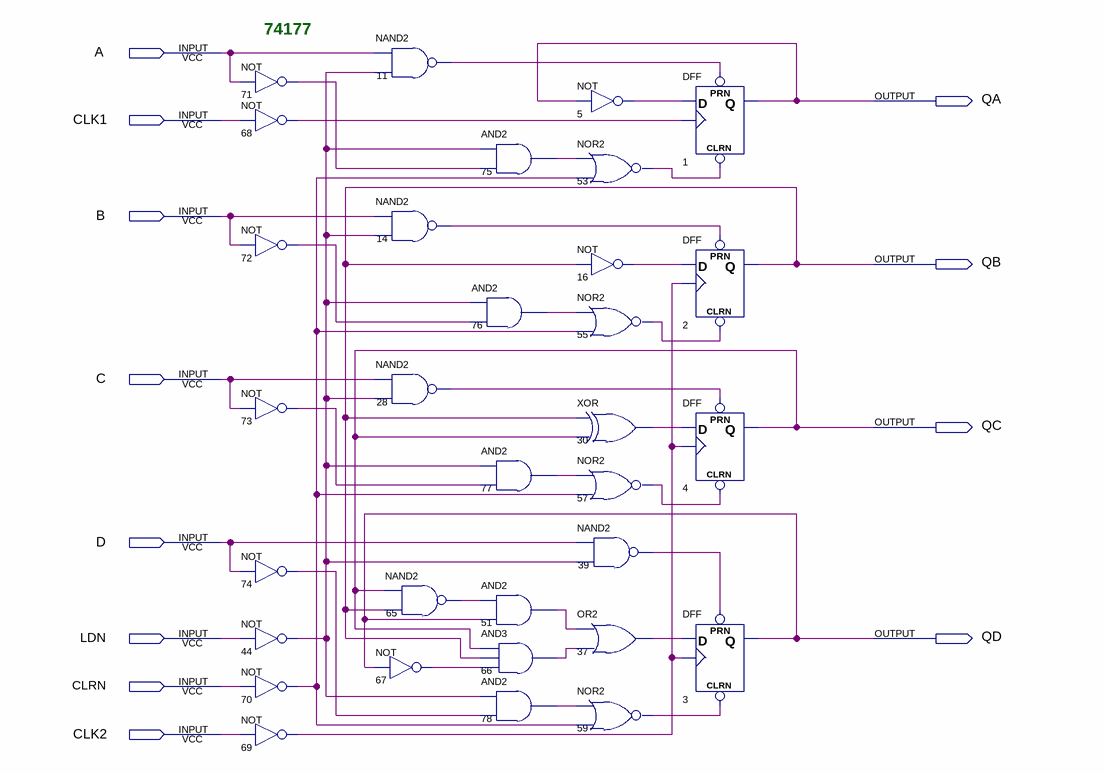
[diagram p0: schematic sheet]
// Quartus schematic 74177.bdf as structural Verilog: 32 symbols, 12 pins
module \74177  (
  input  A,
  input  CLK1,
  input  B,
  input  C,
  input  D,
  input  LDN,
  input  CLRN,
  input  CLK2,
  output QA,
  output QB,
  output QC,
  output QD
);

  wire n5_out, n11_out, n14_out, n16_out, n28_out, n30_out, n37_out, n39_out, n44_out, n51_out, n53_out,
       n55_out, n57_out, n59_out, n65_out, n66_out, n67_out, n68_out, n69_out, n70_out, n71_out, n72_out,
       n73_out, n74_out, n75_out, n76_out, n77_out, n78_out;

  not u_71 (n71_out, A);
  not u_68 (n68_out, CLK1);
  not u_72 (n72_out, B);
  not u_73 (n73_out, C);
  not u_74 (n74_out, D);
  not u_44 (n44_out, LDN);
  not u_70 (n70_out, CLRN);
  not u_69 (n69_out, CLK2);
  nand u_11 (n11_out, A, n44_out);
  nand u_14 (n14_out, B, n44_out);
  nand u_28 (n28_out, C, n44_out);
  not u_67 (n67_out, QD);
  nand u_65 (n65_out, QC, QB);
  and u_75 (n75_out, n44_out, n71_out);
  and u_76 (n76_out, n44_out, n72_out);
  and u_77 (n77_out, n44_out, n73_out);
  and u_51 (n51_out, n65_out, QD);
  and u_66 (n66_out, QC, QB, n67_out);
  and u_78 (n78_out, n44_out, n74_out);
  not u_5 (n5_out, QA);
  nor u_53 (n53_out, n75_out, n70_out);
  not u_16 (n16_out, QB);
  nor u_55 (n55_out, n76_out, n70_out);
  xor u_30 (n30_out, QB, QC);
  nor u_57 (n57_out, n77_out, n70_out);
  nand u_39 (n39_out, D, n44_out);
  or u_37 (n37_out, n51_out, n66_out);
  nor u_59 (n59_out, n78_out, n70_out);
  DFF u_1 (.CLRN(n53_out), .CLK(n68_out), .D(n5_out), .PRN(n11_out), .Q(QA));
  DFF u_2 (.CLRN(n55_out), .CLK(n69_out), .D(n16_out), .PRN(n14_out), .Q(QB));
  DFF u_4 (.CLRN(n57_out), .CLK(n69_out), .D(n30_out), .PRN(n28_out), .Q(QC));
  DFF u_3 (.CLRN(n59_out), .CLK(n69_out), .D(n37_out), .PRN(n39_out), .Q(QD));

  // Notes on the sheet:
  //   74177
endmodule
